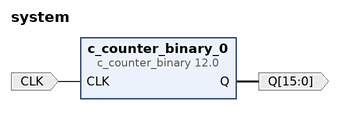
[diagram p0: block diagram of the top level]
# Vivado block design system, xc7a50tfgg484-1, Vivado 2017.4
create_bd_design system

create_bd_port -dir I -type clk CLK
set_property -dict {CONFIG.FREQ_HZ 10000000} [get_bd_ports CLK]
create_bd_port -dir O -from 15 -to 0 -type data Q

create_bd_cell -type ip -vlnv xilinx.com:ip:c_counter_binary:12.0 c_counter_binary_0

# ---- connections ----

connect_bd_net [get_bd_ports CLK] [get_bd_pins c_counter_binary_0/CLK]
connect_bd_net [get_bd_pins c_counter_binary_0/Q] [get_bd_ports Q]

validate_bd_design
save_bd_design
